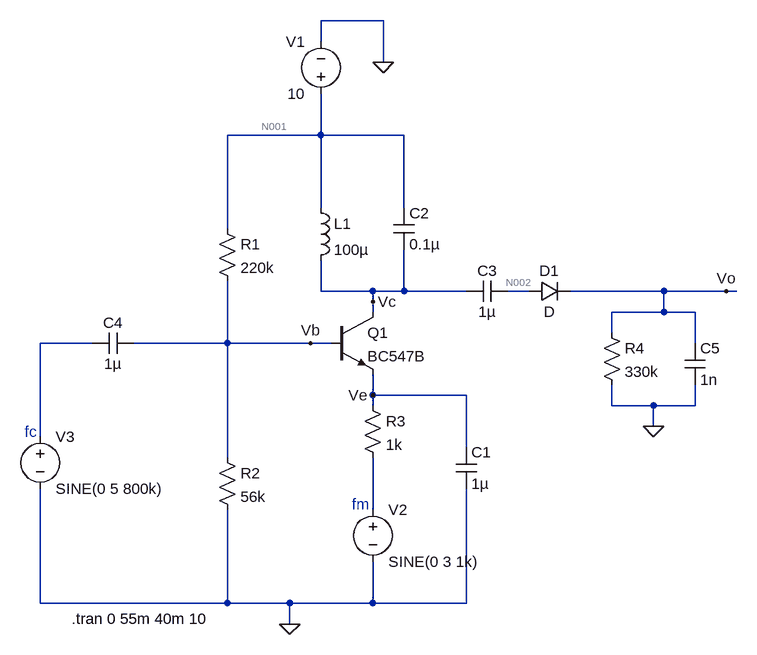
[diagram p0: schematic Draft1_demodulation.asc]
Draft1_demodulation.asc, the LTspice schematic file:
Version 4
SHEET 1 880 688
WIRE 304 -272 208 -272
WIRE 208 -240 208 -272
WIRE 304 -208 304 -272
WIRE 208 -96 208 -160
WIRE 208 -96 64 -96
WIRE 336 -96 208 -96
WIRE 208 16 208 -96
WIRE 336 16 336 -96
WIRE 64 48 64 -96
WIRE 208 144 208 96
WIRE 288 144 208 144
WIRE 336 144 336 80
WIRE 336 144 288 144
WIRE 432 144 336 144
WIRE 528 144 496 144
WIRE 736 144 592 144
WIRE 832 144 736 144
WIRE 848 144 832 144
WIRE 288 160 288 144
WIRE 288 176 288 160
WIRE 736 176 736 144
WIRE 736 176 656 176
WIRE 784 176 736 176
WIRE 656 208 656 176
WIRE -144 224 -224 224
WIRE 64 224 64 128
WIRE 64 224 -80 224
WIRE 192 224 64 224
WIRE 224 224 192 224
WIRE 784 224 784 176
WIRE 288 304 288 272
WIRE 432 304 288 304
WIRE 288 320 288 304
WIRE 656 320 656 288
WIRE 720 320 656 320
WIRE 784 320 784 288
WIRE 784 320 720 320
WIRE 720 352 720 320
WIRE -224 368 -224 224
WIRE 432 384 432 304
WIRE 64 400 64 224
WIRE 288 480 288 400
WIRE -224 624 -224 448
WIRE 64 624 64 480
WIRE 64 624 -224 624
WIRE 160 624 64 624
WIRE 288 624 288 560
WIRE 288 624 160 624
WIRE 432 624 432 448
WIRE 432 624 288 624
WIRE 160 656 160 624
FLAG 304 -208 0
FLAG 160 656 0
FLAG 288 160 Vc
FLAG 192 224 Vb
FLAG 288 304 Ve
FLAG 720 352 0
FLAG 832 144 Vo
SYMBOL res 48 32 R0
SYMATTR InstName R1
SYMATTR Value 220k
SYMBOL res 48 384 R0
SYMATTR InstName R2
SYMATTR Value 56k
SYMBOL res 272 304 R0
SYMATTR InstName R3
SYMATTR Value 1k
SYMBOL ind 192 0 R0
SYMATTR InstName L1
SYMATTR Value 100µ
SYMBOL voltage 208 -144 R180
WINDOW 0 24 96 Left 2
WINDOW 3 24 16 Left 2
WINDOW 123 0 0 Left 0
WINDOW 39 0 0 Left 0
SYMATTR InstName V1
SYMATTR Value 10
SYMBOL npn 224 176 R0
SYMATTR InstName Q1
SYMATTR Value BC547B
SYMBOL voltage 288 464 R0
WINDOW 123 0 0 Left 0
WINDOW 39 0 0 Left 0
SYMATTR InstName V2
SYMATTR Value SINE(0 3 1k)
SYMBOL voltage -224 352 R0
WINDOW 123 0 0 Left 0
WINDOW 39 0 0 Left 0
SYMATTR InstName V3
SYMATTR Value SINE(0 5 800k)
SYMBOL res 640 192 R0
SYMATTR InstName R4
SYMATTR Value 330k
SYMBOL cap 768 224 R0
SYMATTR InstName C5
SYMATTR Value 1n
SYMBOL cap 416 384 R0
SYMATTR InstName C1
SYMATTR Value 1µ
SYMATTR SpiceLine V=16 Irms=0 Rser=11 Lser=0 mfg="AVX" pn="TAJA105K016" type="Ceramic"
SYMBOL cap 320 16 R0
SYMATTR InstName C2
SYMATTR Value 0.1µ
SYMATTR SpiceLine V=100 Irms=1.4 Rser=0.0913262 Lser=0 mfg="KEMET" pn="C0805C104K1RAC" type="X7R"
SYMBOL cap 496 128 R90
WINDOW 0 0 32 VBottom 2
WINDOW 3 32 32 VTop 2
SYMATTR InstName C3
SYMATTR Value 1µ
SYMATTR SpiceLine V=16 Irms=0 Rser=11 Lser=0 mfg="AVX" pn="TAJA105K016" type="Ceramic"
SYMBOL cap -80 208 R90
WINDOW 0 0 32 VBottom 2
WINDOW 3 32 32 VTop 2
SYMATTR InstName C4
SYMATTR Value 1µ
SYMATTR SpiceLine V=16 Irms=0 Rser=11 Lser=0 mfg="AVX" pn="TAJA105K016" type="Ceramic"
SYMBOL diode 528 160 R270
WINDOW 0 32 32 VTop 2
WINDOW 3 0 32 VBottom 2
SYMATTR InstName D1
TEXT 256 472 Left 2 ;fm
TEXT -248 360 Left 2 ;fc
TEXT -176 648 Left 2 !.tran 0 55m 40m 10

The netlist it stands for:
* Draft1_demodulation.asc
R1 N001 Vb 220k
R2 Vb 0 56k
R3 Ve N004 1k
L1 N001 Vc 100µ
V1 N001 0 10
Q1 Vc Vb Ve 0 BC547B
V2 N004 0 SINE(0 3 1k)
V3 N003 0 SINE(0 5 800k)
R4 Vo 0 330k
C5 Vo 0 1n
C1 Ve 0 1µ V=16 Irms=0 Rser=11 Lser=0 mfg="AVX" pn="TAJA105K016" type="Ceramic"
C2 N001 Vc 0.1µ V=100 Irms=1.4 Rser=0.0913262 Lser=0 mfg="KEMET" pn="C0805C104K1RAC" type="X7R"
C3 N002 Vc 1µ V=16 Irms=0 Rser=11 Lser=0 mfg="AVX" pn="TAJA105K016" type="Ceramic"
C4 Vb N003 1µ V=16 Irms=0 Rser=11 Lser=0 mfg="AVX" pn="TAJA105K016" type="Ceramic"
D1 N002 Vo D
.model D D
.lib standard.dio
.model NPN NPN
.model PNP PNP
.lib standard.bjt
* fm
* fc
.tran 0 55m 40m 10
.backanno
.end

* Results of the author's LTspice run, read from the files saved beside the schematic
* Operating Point, zero values left out:
*   V(n001) = 10 V
*   V(vb) = 1.859 V
*   V(ve) = 1.218 V
*   V(vc) = 10 V
*   V(n002) = 7.211 µV
*   Ic(Q1) = 1.215 mA
*   Ib(Q1) = 3.802 µA
*   Ie(Q1) = -1.218 mA
*   I(L1) = 1.215 mA
*   I(R3) = 1.218 mA
*   I(R2) = 33.2 µA
*   I(R1) = 37 µA
*   I(V2) = 1.218 mA
*   I(V1) = -1.252 mA